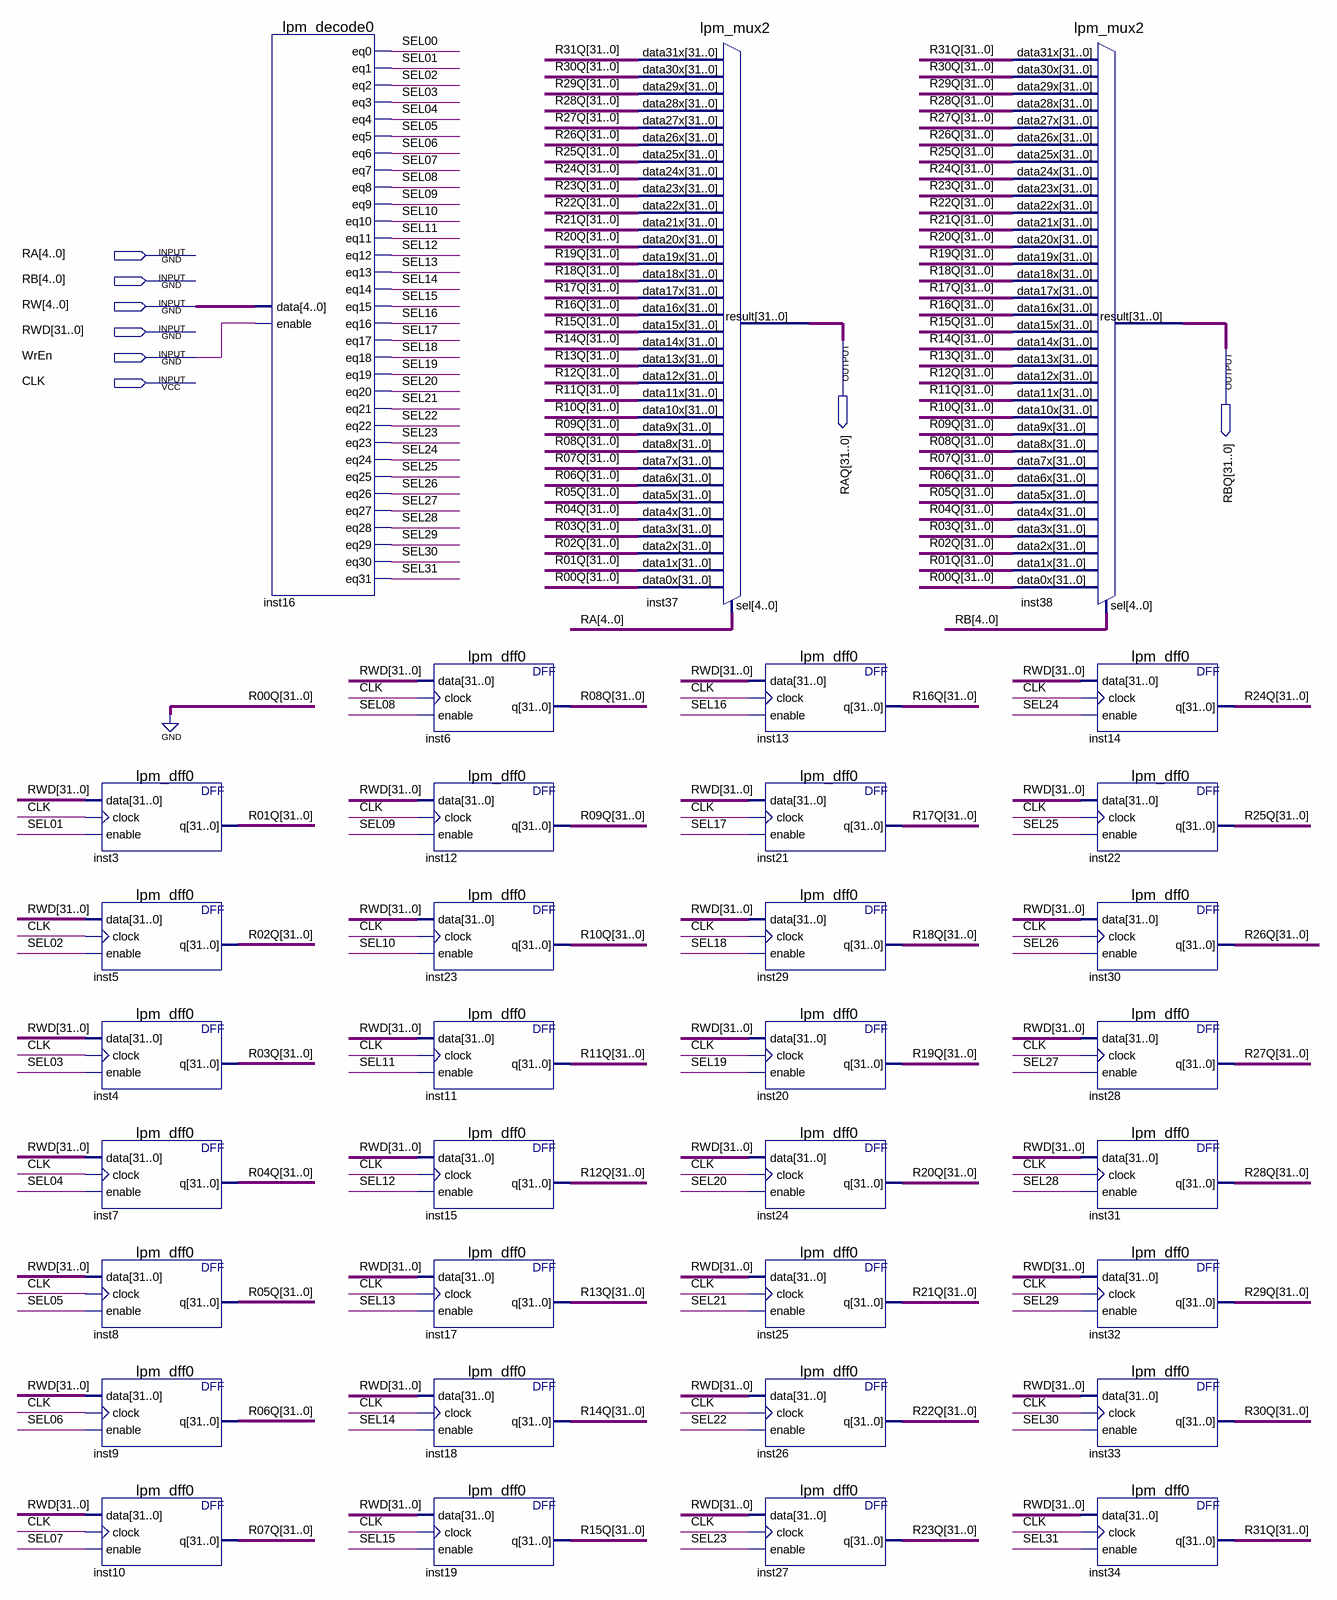
[diagram p0: schematic sheet]
// Quartus schematic GPRs.bdf as structural Verilog: 34 symbols, 8 pins
module GPRs (
  input  [4:0] RA,
  input  [4:0] RB,
  input  [4:0] RW,
  input  [31:0] RWD,
  input  WrEn,
  input  CLK,
  output [31:0] RAQ,
  output [31:0] RBQ
);

  wire SEL00, SEL01, SEL02, SEL03, SEL04, SEL05, SEL06, SEL07, SEL08, SEL09, SEL10, SEL11, SEL12, SEL13,
       SEL14, SEL15, SEL16, SEL17, SEL18, SEL19, SEL20, SEL21, SEL22, SEL23, SEL24, SEL25, SEL26, SEL27,
       SEL28, SEL29, SEL30, SEL31;
  wire [31:0] R01Q, R02Q, R03Q, R04Q, R05Q, R06Q, R07Q, R08Q, R09Q, R10Q, R11Q, R12Q, R13Q, R14Q, R15Q, R16Q,
       R17Q, R18Q, R19Q, R20Q, R21Q, R22Q, R23Q, R24Q, R25Q, R26Q, R27Q, R28Q, R29Q, R30Q, R31Q;

  lpm_dff0 inst3 (.data(RWD), .clock(CLK), .enable(SEL01), .q(R01Q));
  lpm_dff0 inst5 (.data(RWD), .clock(CLK), .enable(SEL02), .q(R02Q));
  lpm_dff0 inst4 (.data(RWD), .clock(CLK), .enable(SEL03), .q(R03Q));
  lpm_dff0 inst7 (.data(RWD), .clock(CLK), .enable(SEL04), .q(R04Q));
  lpm_dff0 inst8 (.data(RWD), .clock(CLK), .enable(SEL05), .q(R05Q));
  lpm_dff0 inst9 (.data(RWD), .clock(CLK), .enable(SEL06), .q(R06Q));
  lpm_dff0 inst10 (.data(RWD), .clock(CLK), .enable(SEL07), .q(R07Q));
  lpm_decode0 inst16 (
    .data(RW), .enable(WrEn), .eq0(SEL00), .eq1(SEL01), .eq2(SEL02), .eq3(SEL03), .eq4(SEL04), .eq5(SEL05),
    .eq6(SEL06), .eq7(SEL07), .eq8(SEL08), .eq9(SEL09), .eq10(SEL10), .eq11(SEL11), .eq12(SEL12),
    .eq13(SEL13), .eq14(SEL14), .eq15(SEL15), .eq16(SEL16), .eq17(SEL17), .eq18(SEL18), .eq19(SEL19),
    .eq20(SEL20), .eq21(SEL21), .eq22(SEL22), .eq23(SEL23), .eq24(SEL24), .eq25(SEL25), .eq26(SEL26),
    .eq27(SEL27), .eq28(SEL28), .eq29(SEL29), .eq30(SEL30), .eq31(SEL31));
  lpm_dff0 inst6 (.data(RWD), .clock(CLK), .enable(SEL08), .q(R08Q));
  lpm_dff0 inst12 (.data(RWD), .clock(CLK), .enable(SEL09), .q(R09Q));
  lpm_dff0 inst23 (.data(RWD), .clock(CLK), .enable(SEL10), .q(R10Q));
  lpm_dff0 inst11 (.data(RWD), .clock(CLK), .enable(SEL11), .q(R11Q));
  lpm_dff0 inst15 (.data(RWD), .clock(CLK), .enable(SEL12), .q(R12Q));
  lpm_dff0 inst17 (.data(RWD), .clock(CLK), .enable(SEL13), .q(R13Q));
  lpm_dff0 inst18 (.data(RWD), .clock(CLK), .enable(SEL14), .q(R14Q));
  lpm_dff0 inst19 (.data(RWD), .clock(CLK), .enable(SEL15), .q(R15Q));
  lpm_mux2 inst37 (
    .data31x(R31Q), .data30x(R30Q), .data29x(R29Q), .data28x(R28Q), .data27x(R27Q), .data26x(R26Q),
    .data25x(R25Q), .data24x(R24Q), .data23x(R23Q), .data22x(R22Q), .data21x(R21Q), .data20x(R20Q),
    .data19x(R19Q), .data18x(R18Q), .data17x(R17Q), .data16x(R16Q), .data15x(R15Q), .data14x(R14Q),
    .data13x(R13Q), .data12x(R12Q), .data11x(R11Q), .data10x(R10Q), .data9x(R09Q), .data8x(R08Q),
    .data7x(R07Q), .data6x(R06Q), .data5x(R05Q), .data4x(R04Q), .data3x(R03Q), .data2x(R02Q), .data1x(R01Q),
    .data0x({32{1'b0}}), .sel(RA), .result(RAQ));
  lpm_dff0 inst13 (.data(RWD), .clock(CLK), .enable(SEL16), .q(R16Q));
  lpm_dff0 inst21 (.data(RWD), .clock(CLK), .enable(SEL17), .q(R17Q));
  lpm_dff0 inst29 (.data(RWD), .clock(CLK), .enable(SEL18), .q(R18Q));
  lpm_dff0 inst20 (.data(RWD), .clock(CLK), .enable(SEL19), .q(R19Q));
  lpm_dff0 inst24 (.data(RWD), .clock(CLK), .enable(SEL20), .q(R20Q));
  lpm_dff0 inst25 (.data(RWD), .clock(CLK), .enable(SEL21), .q(R21Q));
  lpm_dff0 inst26 (.data(RWD), .clock(CLK), .enable(SEL22), .q(R22Q));
  lpm_dff0 inst27 (.data(RWD), .clock(CLK), .enable(SEL23), .q(R23Q));
  lpm_mux2 inst38 (
    .data31x(R31Q), .data30x(R30Q), .data29x(R29Q), .data28x(R28Q), .data27x(R27Q), .data26x(R26Q),
    .data25x(R25Q), .data24x(R24Q), .data23x(R23Q), .data22x(R22Q), .data21x(R21Q), .data20x(R20Q),
    .data19x(R19Q), .data18x(R18Q), .data17x(R17Q), .data16x(R16Q), .data15x(R15Q), .data14x(R14Q),
    .data13x(R13Q), .data12x(R12Q), .data11x(R11Q), .data10x(R10Q), .data9x(R09Q), .data8x(R08Q),
    .data7x(R07Q), .data6x(R06Q), .data5x(R05Q), .data4x(R04Q), .data3x(R03Q), .data2x(R02Q), .data1x(R01Q),
    .data0x({32{1'b0}}), .sel(RB), .result(RBQ));
  lpm_dff0 inst14 (.data(RWD), .clock(CLK), .enable(SEL24), .q(R24Q));
  lpm_dff0 inst22 (.data(RWD), .clock(CLK), .enable(SEL25), .q(R25Q));
  lpm_dff0 inst30 (.data(RWD), .clock(CLK), .enable(SEL26), .q(R26Q));
  lpm_dff0 inst28 (.data(RWD), .clock(CLK), .enable(SEL27), .q(R27Q));
  lpm_dff0 inst31 (.data(RWD), .clock(CLK), .enable(SEL28), .q(R28Q));
  lpm_dff0 inst32 (.data(RWD), .clock(CLK), .enable(SEL29), .q(R29Q));
  lpm_dff0 inst33 (.data(RWD), .clock(CLK), .enable(SEL30), .q(R30Q));
  lpm_dff0 inst34 (.data(RWD), .clock(CLK), .enable(SEL31), .q(R31Q));
endmodule
